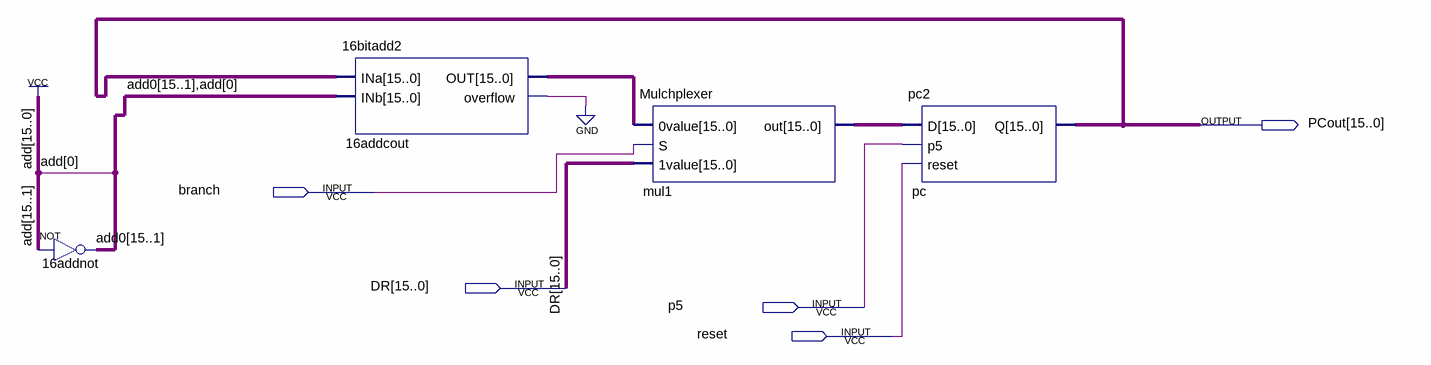
[diagram p0: schematic sheet]
// Quartus schematic pc2withcount.bdf as structural Verilog: 4 symbols, 5 pins
module pc2withcount (
  input  branch,
  input  [15:0] DR,
  input  p5,
  input  reset,
  output [15:0] PCout
);

  wire n16addcout_overflow;
  wire [15:0] mul1_out, n16addcout_out;
  wire [15:1] add0;

  assign add0 = ~{15{1'b1}};  // NOT 16addnot, 15 bits wide
  \16bitadd2  u_16addcout (.INa(PCout), .INb({add0, 1'b1}), .OUT(n16addcout_out), .overflow(n16addcout_overflow));
  Mulchplexer mul1 (.\0value (n16addcout_out), .S(branch), .\1value (DR), .out(mul1_out));
  pc2 pc (.D(mul1_out), .p5(p5), .reset(reset), .Q(PCout));
  // also tied to GND on the sheet: n16addcout_overflow
endmodule
